# EAGLE design TDA1308_DualHPAmp (EAGLE 7.2.0)
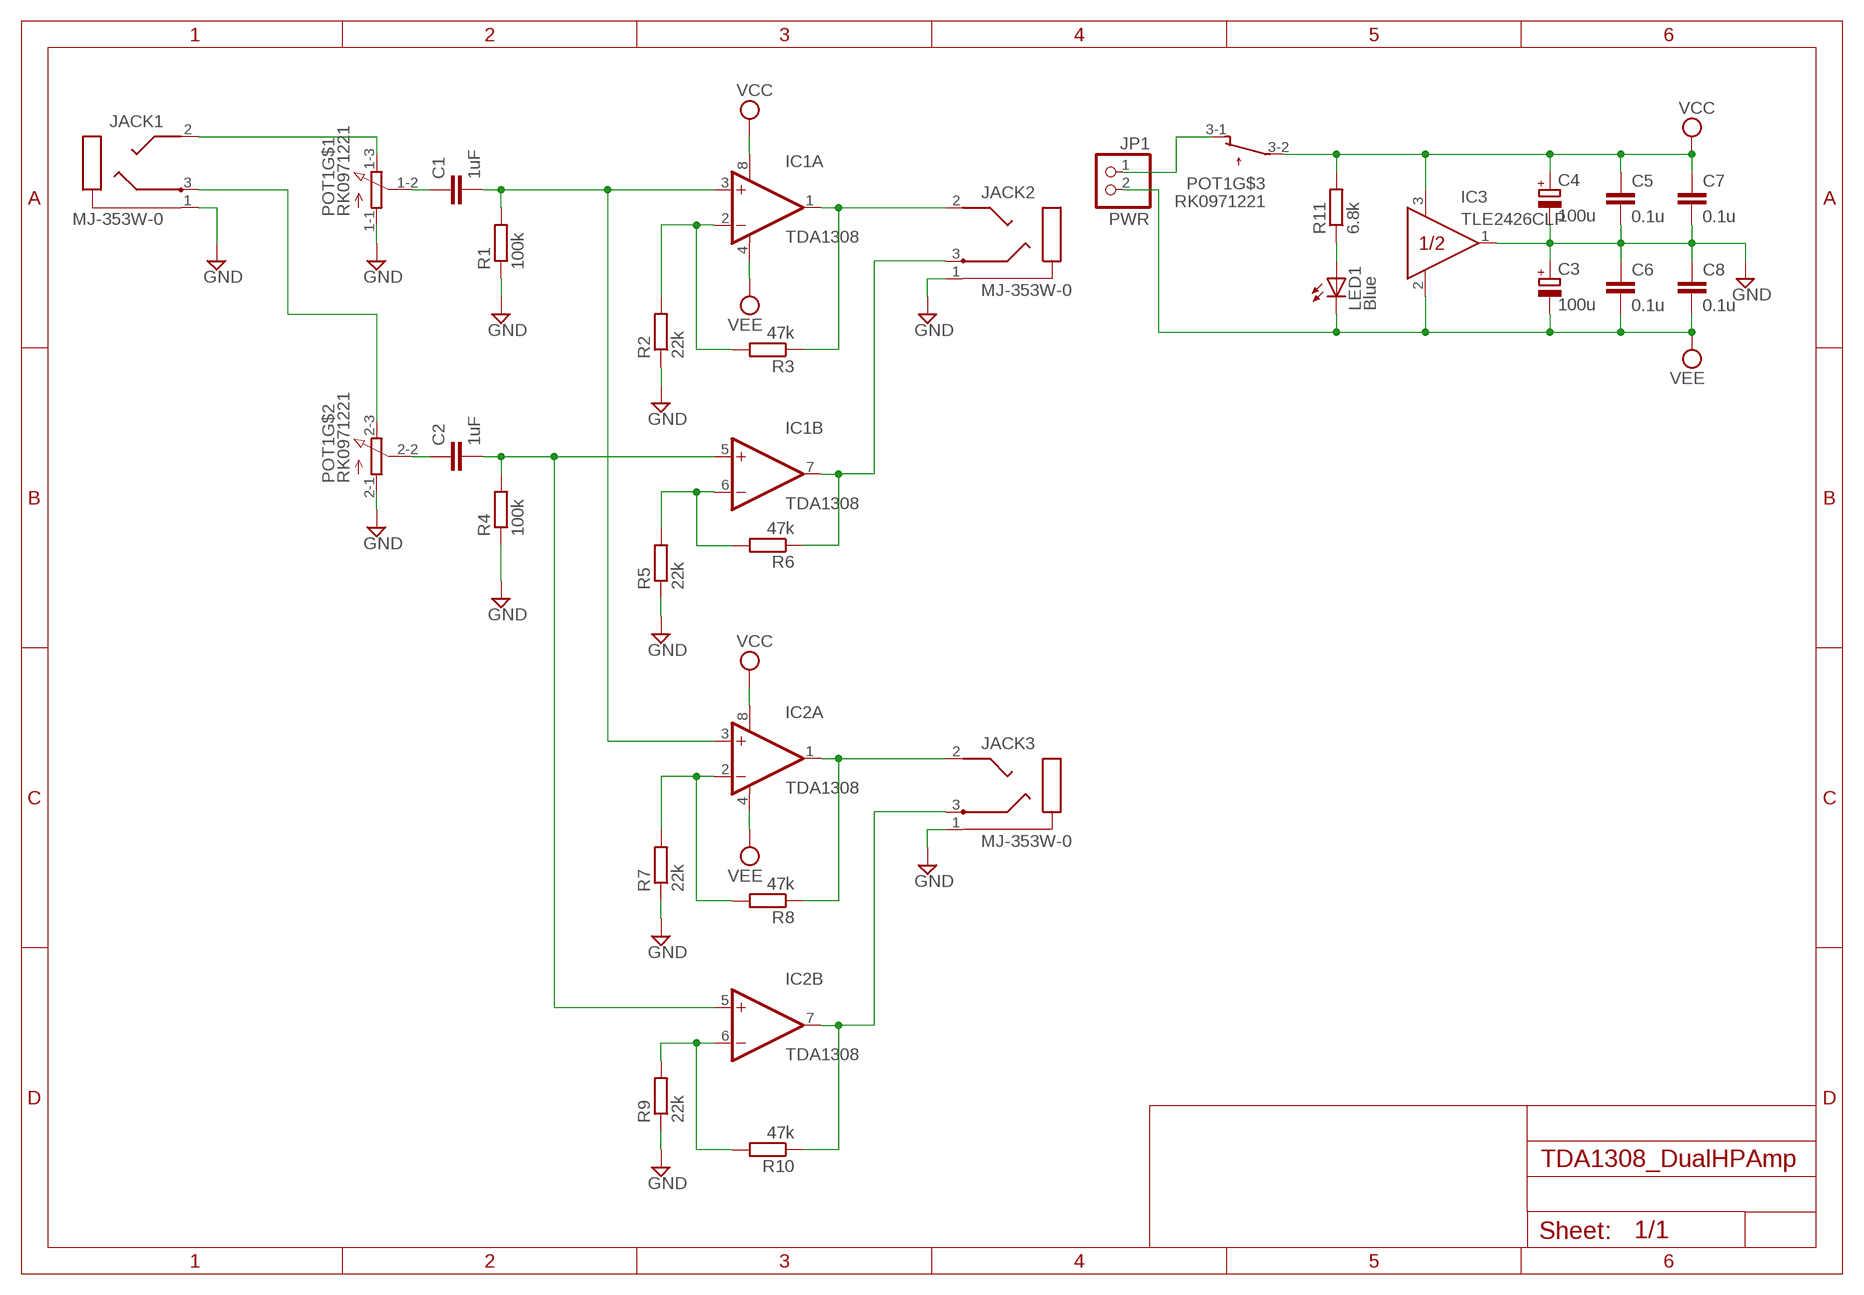
[diagram p0: schematic, sheet 1]

## Parts
C1  1uF  C-EU050-050X075  [C050-050X075]
C2  1uF  C-EU050-050X075  [C050-050X075]
C3  100u  CPOL-EUE2.5-7  [E2,5-7]
C4  100u  CPOL-EUE2.5-7  [E2,5-7]
C5  0.1u  C-EU050-024X044  [C050-024X044]
C6  0.1u  C-EU025-024X044  [C025-024X044]
C7  0.1u  C-EU050-024X044  [C050-024X044]
C8  0.1u  C-EU025-024X044  [C025-024X044]
IC1  TDA1308  OPA2134P  [DIL08]
IC2  TDA1308  OPA2134P  [DIL08]
IC3  TLE2426CLP  [TO226AA]
JACK1  MJ-353W-0  [MJ-3052W-0]
JACK2  MJ-353W-0  [MJ-3052W-0]
JACK3  MJ-353W-0  [MJ-3052W-0]
JP1  PWR  PINHD-1X2  [1X02]
LED1  Blue  LED3MM  [LED3MM]
POT1  RK0971221  [RK0971221]
R1  100k  R-EU_0207/2V  [0207/2V]
R2  22k  R-EU_0207/2V  [0207/2V]
R3  47k  R-EU_0207/2V  [0207/2V]
R4  100k  R-EU_0207/2V  [0207/2V]
R5  22k  R-EU_0207/7  [0207/7]
R6  47k  R-EU_0207/2V  [0207/2V]
R7  22k  R-EU_0207/2V  [0207/2V]
R8  47k  R-EU_0207/2V  [0207/2V]
R9  22k  R-EU_0207/2V  [0207/2V]
R10  47k  R-EU_0207/2V  [0207/2V]
R11  6.8k  R-EU_0207/7  [0207/7]

## Nets
GND: C3.+ C4.- C5.2 C6.1 C7.2 C8.1 IC3.1(OUT) JACK1.1 JACK2.1 JACK3.1 POT1.1-1(A) POT1.2-1(A) R1.1 R2.1 R4.1 R5.1 R7.1 R9.1
N$1: JACK1.2 POT1.1-3(E)
N$2: JACK1.3 POT1.2-3(E)
N$3: C1.1 POT1.1-2(S)
N$4: C2.1 POT1.2-2(S)
N$5: C2.2 IC1.5(B:+IN) IC2.5(B:+IN) R4.2
N$6: C1.2 IC1.3(A:+IN) IC2.3(A:+IN) R1.2
N$7: IC1.2(A:-IN) R2.2 R3.2
N$8: IC1.1(A:OUT) JACK2.2 R3.1
N$9: IC1.6(B:-IN) R5.2 R6.2
N$10: JP1.1 POT1.3-1(O)
N$11: IC1.7(B:OUT) JACK2.3 R6.1
N$12: IC2.2(A:-IN) R7.2 R8.2
N$13: LED1.A R11.1
N$14: IC2.6(B:-IN) R9.2 R10.2
N$16: IC2.1(A:OUT) JACK3.2 R8.1
N$18: IC2.7(B:OUT) JACK3.3 R10.1
VCC: C4.+ C5.1 C7.1 IC1.8(A:V+) IC2.8(A:V+) IC3.3(IN) POT1.3-2(P) R11.2
VEE: C3.- C6.2 C8.2 IC1.4(A:V-) IC2.4(A:V-) IC3.2(COM) JP1.2 LED1.K(C)

## Library data of the parts
C1 C2 C5-C8 = rcl:C-EU: CAPACITOR, European symbol
C3 C4 = rcl:CPOL-EU: POLARIZED CAPACITOR, European symbol
IC1 IC2 = burr-brown:OPA2134: Operational Amplifier; MF: TEXAS INSTRUMENTS; MPN: OPA2134PA; OC_FARNELL: 1097574; OC_NEWARK: 74K3897
IC3 = tle2426:TLE2426*L: Texas Instruments "rail splitter". No noise-reduction pin.
JACK1-JACK3 = mylib2:MJ-353W-0: マル信 3.5mmステレオジャック
JP1 = pinhead:PINHD-1X2: PIN HEADER
LED1 = led:LED: LED OSRAM: - CHIPLED LG R971, LG N971, LY N971, LG Q971, LY Q971, LO R971, LY R971 LH N974, LH R974 LS Q976, LO Q976, LY Q976 LO Q996 - Hyper CHIPLED LW Q18S LB Q993, LB Q99A, LB R99A - SideLED LS A670, LO A670, LY A670, LG A670, LP A670 LB A673, LV A673, LT A673, LW A673 LH A674 LY A675 LS A676, LA A676, LO A676, LY A676, LW A676 LS A679, LY A679, LG A679 - Hyper Micro SIDELED® LS Y876, LA Y876, LO Y876, LY Y876 LT Y87S - SmartLED LW L88C, LW L88S LB L89C, LB L89S, LG L890 LS L89K, LO L89K, LY L89K LS L896, LA L896, LO L896, LY L896 - TOPLED LS T670, LO T670, LY T670, LG T670, LP T670 LSG T670, LSP T670, LSY T670, LOP T670, LYG T670 LG T671, LOG T671, LSG T671 LB T673, LV T673, LT T673, LW T673 LH T674 LS T676, LA T676, LO T676, LY T676, LB T676, LH T676, LSB T676, LW T676 LB T67C, LV T67C, LT T67C, LS T67K, LO T67K, LY T67K, LW E67C LS E67B, LA E67B, LO E67B, LY E67B, LB E67C, LV E67C, LT E67C LW T67C LS T679, LY T679, LG T679 LS T770, LO T770, LY T770, LG T770, LP T770 LB T773, LV T773, LT T773, LW T773 LH T774 LS E675, LA E675, LY E675, LS T675 LS T776, LA T776, LO T776, LY T776, LB T776 LHGB T686 LT T68C, LB T68C - Hyper Mini TOPLED® LB M676 - Mini TOPLED Santana® LG M470 LS M47K, LO M47K, LY M47K Source: http://www.osram.convergy.de LUXEON: - LUMILED® LXK2-PW12-R00, LXK2-PW12-S00, LXK2-PW14-U00, LXK2-PW14-V00 LXK2-PM12-R00, LXK2-PM12-S00, LXK2-PM14-U00 LXK2-PE12-Q00, LXK2-PE12-R00, LXK2-PE12-S00, LXK2-PE14-T00, LXK2-PE14-U00 LXK2-PB12-K00, LXK2-PB12-L00, LXK2-PB12-M00, LXK2-PB14-N00, LXK2-PB14-P00, LXK2-PB14-Q00 LXK2-PR12-L00, LXK2-PR12-M00, LXK2-PR14-Q00, LXK2-PR14-R00 LXK2-PD12-Q00, LXK2-PD12-R00, LXK2-PD12-S00 LXK2-PH12-R00, LXK2-PH12-S00 LXK2-PL12-P00, LXK2-PL12-Q00, LXK2-PL12-R00 Source: www.luxeon.com KINGBRIGHT: KA-3528ASYC Source: www.kingbright.com
POT1 = mylib2:RK0971221: スイッチ付2連可変抵抗 ALPS RK0971221-F15-C0-A103
R1-R11 = rcl:R-EU_: RESISTOR, European symbol

## Board
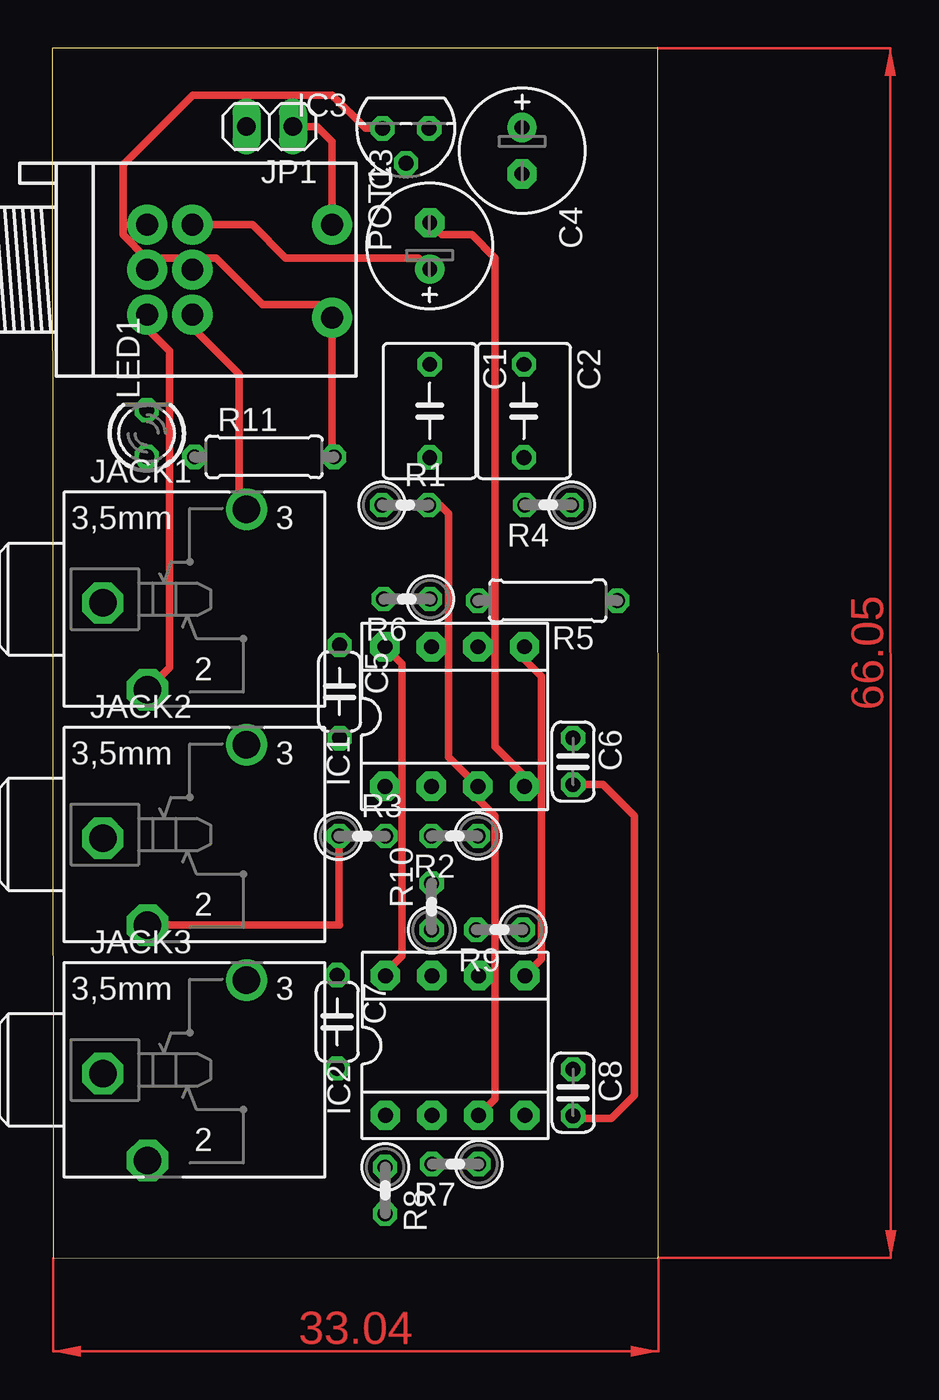
[diagram p1: board, top side]
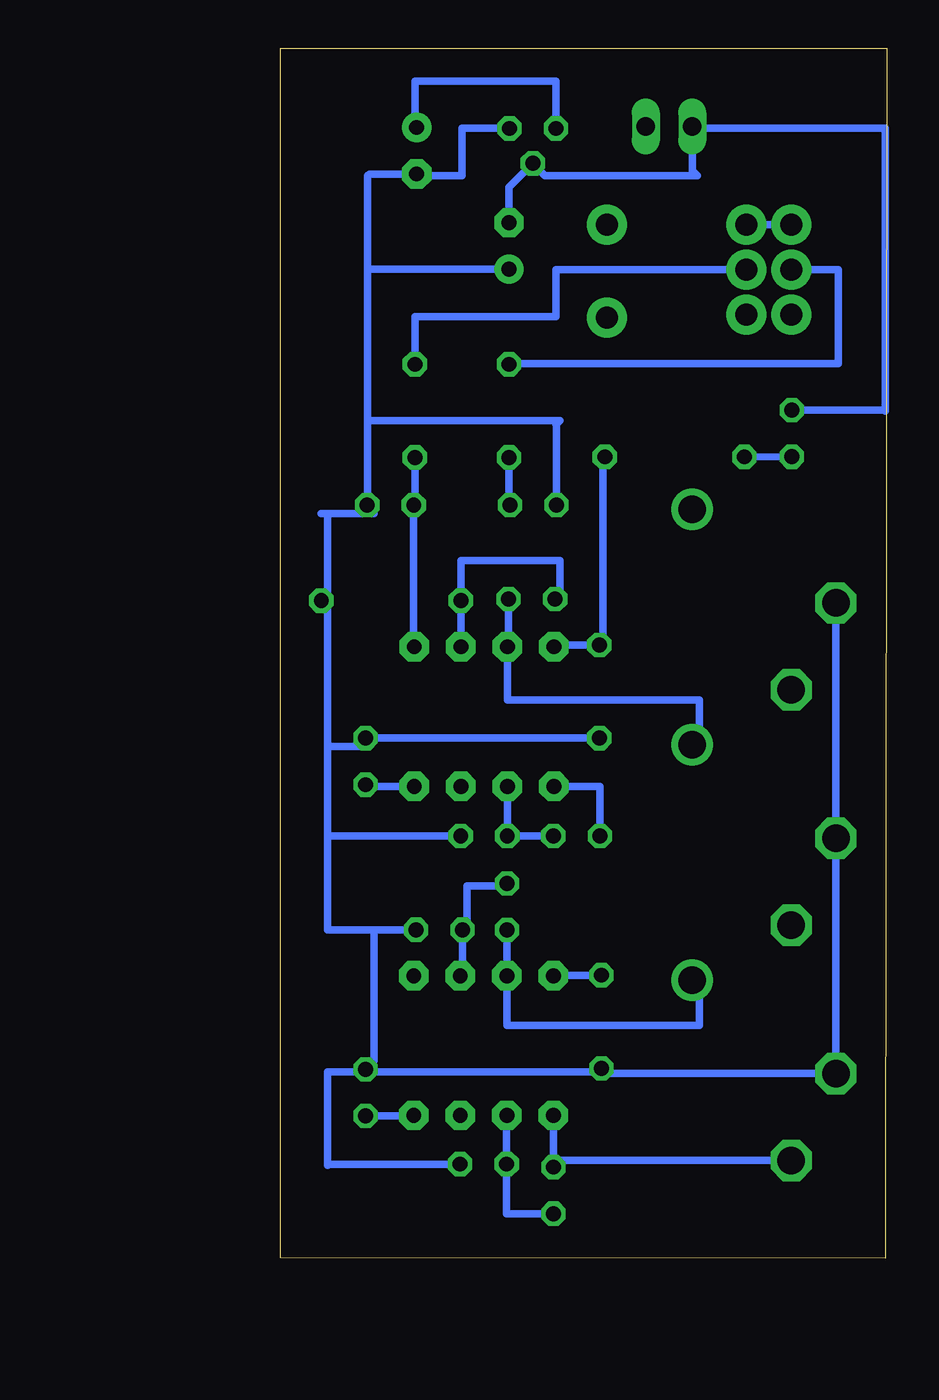
[diagram p2: board, bottom side, seen from below]

Size 33.1 x 66.06 mm. Coordinates in mm from the lower left corner, seen from the top.
Outline: 0.06,0 33.1,0.02 33.09,66.06 0,66.06 0.06,0
Copper layers (1*16): Top 0.035mm / dielectric 1.5mm / Bottom 0.035mm
Design rules "default": minimum track width 10mil, minimum drill 24mil, track to track 8mil, track to pad 8mil, pad to pad 8mil, via to via 8mil, smd to smd 8mil, copper to edge 40mil, drill to drill 8mil, minimum pad ring 10mil, minimum via ring 8mil, stop-mask expansion 4mil, vias tented up to drill 0mil, thermal gap 10mil

### Footprints (pad centres in the part's own frame; a part is rotated, then mirrored left to right if it is on the bottom)
C050-050X075 = drill 0.813 octagon: 1 -2.54,0; 2 2.54,0
E2,5-7 = drill 0.813 pad 1.6: + -1.27,0 | drill 0.813 pad 1.6 octagon: - 1.27,0
C050-024X044 = drill 0.813 octagon: 1 -2.54,0; 2 2.54,0
C025-024X044 = drill 0.813 octagon: 1 -1.27,0; 2 1.27,0
DIL08 = drill 0.813 pad 1.6 octagon: 1 -3.81,-3.81; 2 -1.27,-3.81; 3 1.27,-3.81; 4 3.81,-3.81; 5 3.81,3.81; 6 1.27,3.81; 7 -1.27,3.81; 8 -3.81,3.81
TO226AA = drill 0.813 octagon: 1 -1.27,0; 2 0,1.905; 3 1.27,0
MJ-3052W-0 = drill 1.499 octagon: 1 -5.004,-0.203; 2 -2.563,-4.948 | drill 1.499: 3 2.845,4.902
1X02 = drill 1.016 long: 1 -1.27,0; 2 1.27,0
LED3MM = drill 0.813 octagon: A -1.27,0; K 1.27,0
RK0971221 = drill 1.2 pad 2.184: 1-1 -2.46,0; 1-2 0,0; 1-3 2.46,0; 2-1 -2.46,2.46; 2-2 0,2.46; 2-3 2.46,2.46; 3-1 -2.46,10.08; 3-2 2.62,10.08
0207/2V = drill 0.813 octagon: 1 -1.27,0; 2 1.27,0
0207/7 = drill 0.813 octagon: 1 -3.81,0; 2 3.81,0

### Placement (x,y rotation side)
C1  20.62,46.26 270 top
C2  25.76,46.26 270 top
C3  20.62,55.27 90 top
C4  25.66,60.47 270 top
C5  15.69,30.93 270 top
C6  28.45,27.12 270 top
C7  15.57,12.91 270 top
C8  28.45,9.04 270 top
IC1  21.98,29.57 0 top
IC2  22.01,11.61 0 top
IC3  19.32,61.68 180 top
JACK1  7.77,35.98 0 top
JACK2  7.77,23.13 0 top
JACK3  7.77,10.28 0 top
JP1  11.88,61.78 180 top
LED1  5.17,45.03 90 top
POT1  5.2,53.97 270 top
R1  19.29,41.12 0 top
R2  21.99,23.05 180 top
R3  16.93,23.05 0 top
R4  27.09,41.12 180 top
R5  27.06,35.89 180 top
R6  19.38,35.98 180 top
R7  22.02,5.14 180 top
R8  18.19,3.7 270 top
R9  24.43,17.93 180 top
R10  20.73,19.19 90 top
R11  11.58,43.75 0 top

### Tracks (layer width: path | path; a pad name or v marks a point on that pad's centre or on a via)
GND
  Top 0.406: POT1.2-1 10.94,56.43 12.76,54.61 20.01,54.61 C3.+
  Bottom 0.406: 2.91,23.07 JACK2.1 | JACK1.1 JACK2.1 | 28.33,53.97 28.33,59.11 28.25,59.2 C4.- 25.58,59.11 23.19,59.11 23.19,61.68 IC3.1 | 28.33,53.97 28.33,45.72 | 28.33,45.72 28.33,41.15 R4.1 28,41.12 28,40.64 30.54,40.64 | C3.+ 28.3,54 28.33,53.97 | POT1.1-1 POT1.2-1 | 28.33,45.72 17.84,45.72 18.06,45.51 18.02,45.47 R1.1 | JACK2.1 2.6,22.93 2.6,22.86 2.77,22.86 JACK3.1 15.57,10.08 C7.2 15.3,10.37 15.3,10.16 28.45,10.16 | 15.66,28.39 C5.2 C6.1 28.45,27.94 30.54,27.94 | 30.54,40.64 30.87,40.64 | 30.54,35.89 30.54,27.94 | 27.85,17.93 28,17.78 28,10.76 C8.1 28.45,10.16 | R7.1 30.54,5.14 | 30.54,5.14 30.54,5.08 | 30.54,5.14 30.54,10.16 28.45,10.16 | R5.1 30.54,35.89 | 30.54,35.89 30.54,40.64 | R2.1 30.54,23.05 | 30.54,23.05 30.54,27.94 | R9.1 27.85,17.93 | 27.85,17.93 30.54,17.93 30.54,23.05
N$1
  Top 0.406: POT1.1-3 5.2,50.74 6.41,49.53 6.41,32.23 JACK1.2
N$2
  Top 0.406: POT1.2-3 7.66,50.82 10.22,48.26 10.22,41.28 JACK1.3
N$3
  Bottom 0.406: POT1.1-2 2.63,53.97 2.63,48.83 20.59,48.83 C1.1
N$4
  Bottom 0.406: POT1.2-2 18.05,53.97 18.05,51.4 25.76,51.4 C2.1
N$5
  Top 0.406: IC1.5 25.79,32.69 26.73,31.75 26.73,16.33 IC2.5
  Bottom 0.406: C2.2 25.76,41.18 R4.2 25.82,33.41 IC1.5
N$6
  Top 0.406: R1.2 21.17,41.12 21.65,40.64 21.65,27.36 IC1.3 23.25,25.07 24.19,24.13 24.19,8.71 IC2.3
  Bottom 0.406: C1.2 20.62,41.18 R1.2
N$7
  Bottom 0.406: IC1.2 R2.2 R3.2
N$8
  Top 0.406: JACK2.2 15.66,18.18 | 15.71,18.18 15.66,18.18 | 15.66,18.18 R3.1
  Bottom 0.406: IC1.1 15.66,25.76 R3.1
N$9
  Bottom 0.406: IC1.6 | IC1.6 R5.2 23.25,38.1 17.84,38.1 17.84,35.98 R6.2
N$10
  Top 0.406: JP1.1 14.48,61.78 15.3,60.96 15.3,56.45 POT1.3-1
N$11
  Bottom 0.406: R6.1 20.65,33.38 IC1.7 20.71,30.48 10.22,30.48 10.22,28.03 JACK2.3
N$12
  Bottom 0.406: IC2.2 R7.2 20.75,2.43 R8.2
N$13
  Bottom 0.406: LED1.A 5.23,43.76 R11.1
N$14
  Bottom 0.406: IC2.6 23.16,15.42 R9.2 22.92,17.93 22.92,20.32 20.73,20.32 R10.2
N$16
  Bottom 0.406: IC2.1 18.19,7.8 R8.1 18.19,5.33 JACK3.2
N$18
  Bottom 0.406: R10.1 20.73,15.24 20.38,15.24 20.38,15.42 IC2.7 20.74,12.7 10.22,12.7 10.22,15.18 JACK3.3
VCC
  Top 0.406: IC3.3 17.12,61.68 15.3,63.5 7.68,63.5 3.87,59.69 3.87,55.88 5.14,54.61 8.95,54.61 11.49,52.07 14.56,52.07 POT1.3-2 15.28,43.86 R11.2 | IC2.8 18.2,15.6 19.11,16.51 19.11,32.44 IC1.8
  Bottom 0.406: IC3.3 18.05,64.25 25.76,64.25 25.76,61.84 C4.+ | C7.1 18.17,15.45 IC2.8 | IC1.8 18.08,33.47 C5.1 15.54,33.47 15.48,33.41 15.48,43.69 15.45,43.69 R11.2
VEE
  Top 0.406: C8.2 28.6,7.62 30.54,7.62 31.81,8.89 31.81,24.13 30.09,25.85 C6.2 | IC1.4 25.79,26.34 24.19,27.94 24.19,54.61 22.92,55.88 21.28,55.88 C3.-
  Bottom 0.406: LED1.K 0.1,46.3 0.06,46.26 0.06,61.68 10.51,61.68 JP1.2 10.61,59.38 10.34,59.11 18.66,59.11 IC3.2 20.62,58.48 C3.- | C8.2 25.82,7.77 IC2.4 | IC1.4 28.36,25.76 C6.2
(copper drawn outside any net)
  shapes: Top area x2